# Altium project FC_Design.PrjPcb
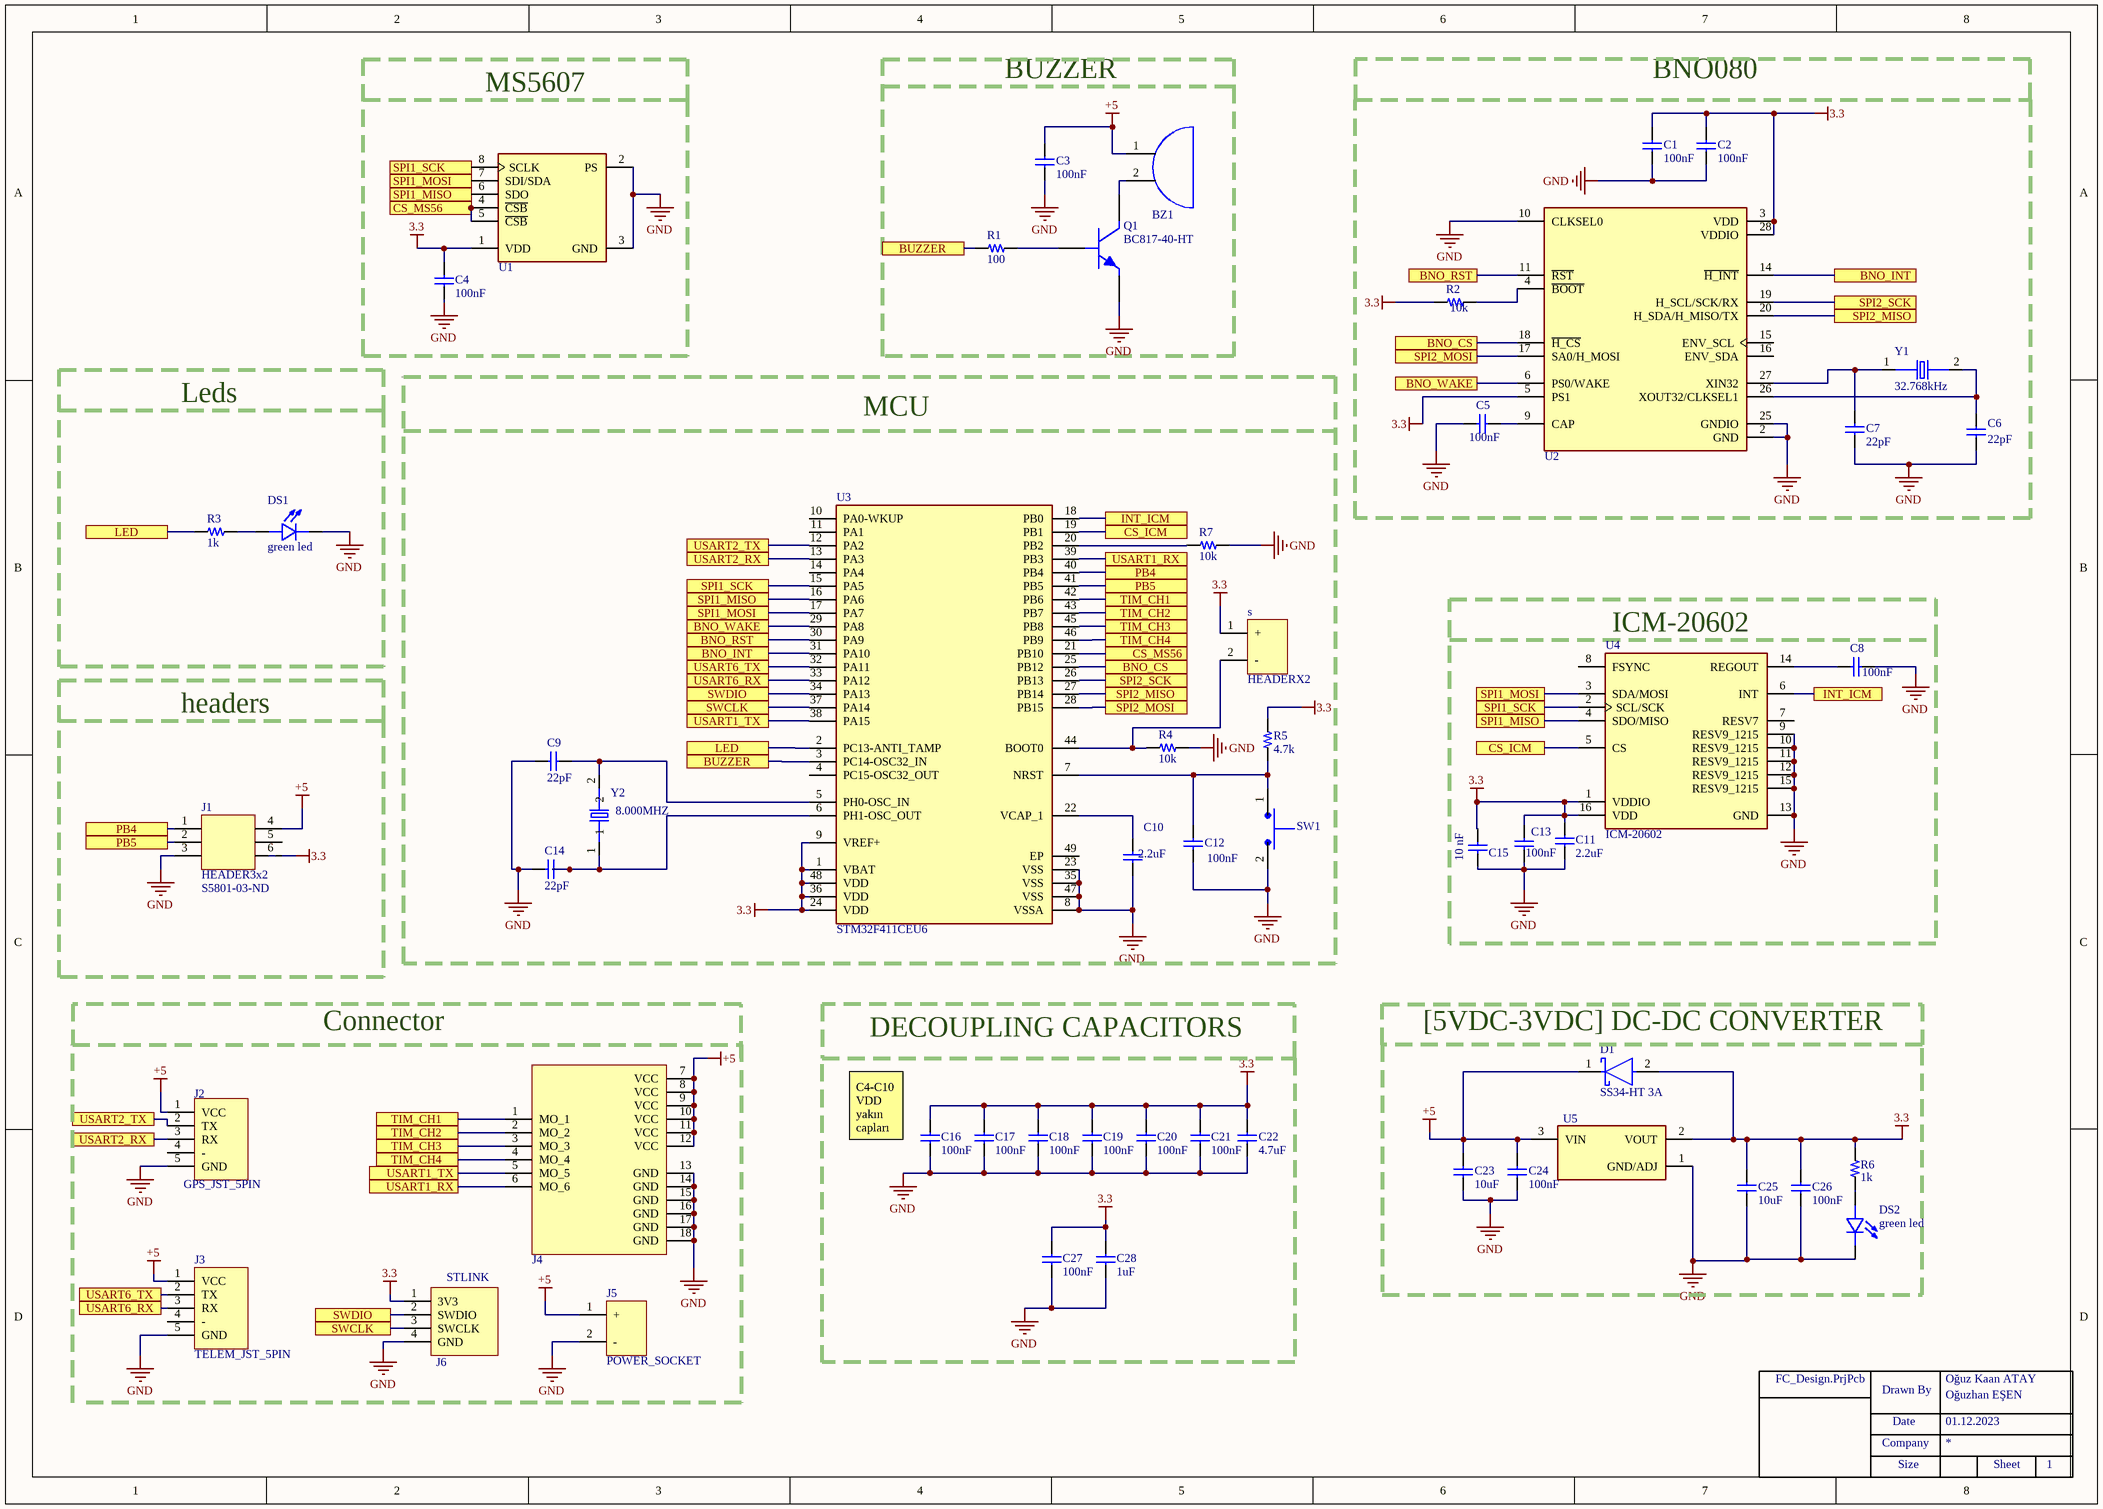
[diagram p0: FC_board.SchDoc]
2 sheets, 55 parts. Net scope: flat (ports and power ports of the same name join across sheets).
Board file: FC_PCB.PcbDoc
Sheets:
  FC_board.SchDoc
  FC_BlockDiagram.SchDoc

## Sheet FC_board.SchDoc
size A3; Date: 01.12.2023; DrawnBy: Oğuz Kaan ATAY; Engineer: Oğuzhan EŞEN; SheetNumber: 1; SheetTotal: 2

### Parts
BZ1  MB9650B05NP  [BUZZER]  (value not drawn)
C1  Capacitance: 100nF  [CAP_0805]  (hidden comment: CL21B105KBFNNNE)
C2  Capacitance: 100nF  [CAP_0805]  (hidden comment: CL21B105KBFNNNE)
C3  Capacitance: 100nF  [CAP_0805]  (hidden comment: CAP CER 100nF 0805)
C4  Capacitance: 100nF  [CAP_0805]  (hidden comment: CAP CER 100nF 0805)
C5  Capacitance: 100nF  [CAP_0805]  (hidden comment: CAP CER  0.1uF 0805)
C6  Capacitance: 22pF  [CAP_0805]  (hidden comment: CL21B105KBFNNNE)
C7  Capacitance: 22pF  [CAP_0805]  (hidden comment: CL21B105KBFNNNE)
C8  Capacitance: 100nF  [CAP_0805]  (hidden comment: CAP CER  0.1uF 0805)
C9  Capacitance: 22pF  [CAP_0805]  (hidden comment: CL21B105KBFNNNE)
C10  Capacitance: 2.2uF  [CAP_0805]  (hidden comment: CL21B105KBFNNNE)
C11  Capacitance: 2.2uF  [CAP_0805]  (hidden comment: CL21A475KAQNNNE)
C12  Capacitance: 100nF  [CAP_0805]
C13  Capacitance: 100nF  [CAP_0805]  (hidden comment: CAP CER  0.1uF 0805)
C14  Capacitance: 22pF  [CAP_0805]  (hidden comment: CL21B105KBFNNNE)
C15  CAP CER 10nF 0805  [CAP_0805]  (value not drawn)
C16  Capacitance: 100nF  [CAP_0805]
C17  Capacitance: 100nF  [CAP_0805]
C18  Capacitance: 100nF  [CAP_0805]
C19  Capacitance: 100nF  [CAP_0805]
C20  Capacitance: 100nF  [CAP_0805]
C21  Capacitance: 100nF  [CAP_0805]
C22  Capacitance: 4.7uF  [CAP_0805]
C23  Capacitance: 10uF  [CAP_0805]  (hidden comment: CAP CER 10uF 0805)
C24  Capacitance: 100nF  [CAP_0805]
C25  Capacitance: 10uF  [CAP_0805]  (hidden comment: CAP CER 10uF 0805)
C26  Capacitance: 100nF  [CAP_0805]
C27  Capacitance: 100nF  [CAP_0805]
C28  Capacitance: 1uF  [CAP_0805]
D1  SS34-HT 3A  [FP-95402-MFG]
DS1  green led  [GREEEN_LED_0805]
DS2  green led  [GREEEN_LED_0805]
J1  HEADER3x2  Supplier Part Number 1: S5801-03-ND  [HEADER3x2]
J2  GPS_JST_5PIN  [JST_5PIN_125]
J3  TELEM_JST_5PIN  [JST_5PIN_125]
J4  Motor_Outputs  [MOTORS]  (value not drawn)
J5  POWER_SOCKET  [JST_2PIN_2.54]
J6  STLINK  [HEADER_4_MALE]
Q1  BC817-40-HT  [SOT23]
R1  100  [RES_0805]
R2  10k  [RES_0805]
R3  1k  [RES_0805]
R4  10k  [RES_0805]
R5  4.7k  [RES_0805]
R6  1k  [RES_0805]
R7  10k  [RES_0805]
s  HEADERX2  [PIN_2.54]
SW1  Switch Tactile  [BUTTON]  (value not drawn)
U1  MS560702BA03-50  [SON125P300X500X100-8N]  (value not drawn)
U2  BNO080  [BNO080]  (value not drawn)
U3  STM32F411CEU6  [QFN50P700X700X60-49N]
U4  ICM-20602  [PQFN50P300X300X80-16N]
U5  LDO Voltage Regulators 1A, 3.3V  [SOT229P700X180-4N]  (value not drawn)
Y1  32.768kHz  [CRYSTAL_32_15]
Y2  8.000MHZ  [ABM3-8.000MHZ-D2Y-T]

### Blocks framed on the sheet
BNO080: C1 C2 C5-C7 R2 U2 Y1
MCU: C9 C10 C12 C14 R4 R5 R7 s SW1 U3 Y2
[5VDC-3VDC] DC-DC CONVERTER: C23-C26 D1 DS2 R6 U5

### Ports
BNO_CS, BNO_INT, BNO_RST, BNO_WAKE, BUZZER, CS_ICM, CS_MS56, INT_ICM, LED, PB4, PB5, SPI1_MISO, SPI1_MOSI, SPI1_SCK, SPI2_MISO, SPI2_MOSI, SPI2_SCK, SWCLK, SWDIO, TIM_CH1, TIM_CH2, TIM_CH3, TIM_CH4, USART1_RX, USART1_TX, USART2_RX, USART2_TX, USART6_RX, USART6_TX

### Nets
3.3: C1.2 C2.2 C4.2 C11.2 C13.1 C15.2 C16.2 C17.2 C18.2 C19.2 C20.2 C21.2 C22.2 C25.2 C26.2 C27.2 C28.2 D1.2(A) J1.6 J6.1(3V3) R2.2 R5.1 R6.1 s.1(+) U1.1(VDD) U2.3(VDD) U2.5(PS1) U2.28(VDDIO) U3.1(VBAT) U3.9(VREF+) U3.24(VDD) U3.36(VDD) U3.48(VDD) U4.1(VDDIO) U4.16(VDD) U5.2(VOUT)
+5: BZ1.1(GND) C3.2 C23.2 C24.2 D1.1(C) J1.4 J2.1(VCC) J3.1(VCC) J4.7(VCC) J4.8(VCC) J4.9(VCC) J4.10(VCC) J4.11(VCC) J4.12(VCC) J5.1(+) U5.3(VIN)
GND: C1.1 C2.1 C3.1 C4.1 C5.1 C6.1 C7.1 C8.2 C9.1 C10.1 C11.1 C12.1 C13.2 C14.1 C15.1 C16.1 C17.1 C18.1 C19.1 C20.1 C21.1 C22.1 C23.1 C24.1 C25.1 C26.1 C27.1 C28.1 DS1.2 DS2.2 J1.3 J2.5(GND) J3.5(GND) J4.13(GND) J4.14(GND) J4.15(GND) J4.16(GND) J4.17(GND) J4.18(GND) J5.2(-) J6.4(GND) Q1.2(E) R4.1 R7.1 SW1.2 U1.2(PS) U1.3(GND) U2.2(GND) U2.10(CLKSEL0) U2.25(GNDIO) U3.8(VSSA) U3.23(VSS) U3.35(VSS) U3.47(VSS) U4.9(RESV9_1215) U4.10(RESV9_1215) U4.11(RESV9_1215) U4.12(RESV9_1215) U4.13(GND) U4.15(RESV9_1215) U5.1(GND/ADJ)
NetBZ1_2: BZ1.2(GND) Q1.3(C)
NetC5_2: C5.2 U2.9(CAP)
NetC6_2: C6.2 U2.26(XOUT32/CLKSEL1) Y1.2
NetC7_2: C7.2 U2.27(XIN32) Y1.1
NetC8_1: C8.1 U4.14(REGOUT)
NetC9_2: C9.2 U3.5(PH0-OSC_IN) Y2.2
NetC10_2: C10.2 U3.22(VCAP_1)
NetC12_2: C12.2 R5.2 SW1.1 U3.7(NRST)
NetC14_2: C14.2 U3.6(PH1-OSC_OUT) Y2.1
NetDS1_1: DS1.1 R3.1
NetDS2_1: DS2.1 R6.2
NetJ1_1: J1.1 U3.40(PB4) ; port PB4
NetJ1_2: J1.2 U3.41(PB5) ; port PB5
NetJ2_2: J2.2(TX) U3.12(PA2) ; port USART2_TX
NetJ2_3: J2.3(RX) U3.13(PA3) ; port USART2_RX
NetJ3_2: J3.2(TX) U3.32(PA11) ; port USART6_TX
NetJ3_3: J3.3(RX) U3.33(PA12) ; port USART6_RX
NetJ4_1: J4.1(MO_1) U3.42(PB6) ; port TIM_CH1
NetJ4_2: J4.2(MO_2) U3.43(PB7) ; port TIM_CH2
NetJ4_3: J4.3(MO_3) U3.45(PB8) ; port TIM_CH3
NetJ4_4: J4.4(MO_4) U3.46(PB9) ; port TIM_CH4
NetJ4_5: J4.5(MO_5) U3.38(PA15) ; port USART1_TX
NetJ4_6: J4.6(MO_6) U3.39(PB3) ; port USART1_RX
NetJ6_2: J6.2(SWDIO) U3.34(PA13) ; port SWDIO
NetJ6_3: J6.3(SWCLK) U3.37(PA14) ; port SWCLK
NetQ1_1: Q1.1(B) R1.1
NetR1_2: R1.2 U3.3(PC14-OSC32_IN) ; port BUZZER
NetR2_1: R2.1 U2.4(~{BOOT})
NetR3_2: R3.2 U3.2(PC13-ANTI_TAMP) ; port LED
NetR4_2: R4.2 s.2(-) U3.44(BOOT0)
NetR7_2: R7.2 U3.20(PB2)
NetU1_4: U1.4(~{CSB}) U1.5(~{CSB}) U3.21(PB10) ; port CS_MS56
NetU1_6: U1.6(SDO) U3.16(PA6) U4.4(SDO/MISO) ; port SPI1_MISO
NetU1_7: U1.7(SDI/SDA) U3.17(PA7) U4.3(SDA/MOSI) ; port SPI1_MOSI
NetU1_8: U1.8(SCLK) U3.15(PA5) U4.2(SCL/SCK) ; port SPI1_SCK
NetU2_6: U2.6(PS0/WAKE) U3.29(PA8) ; port BNO_WAKE
NetU2_11: U2.11(~{RST}) U3.30(PA9) ; port BNO_RST
NetU2_14: U2.14(~{H_INT}) U3.31(PA10) ; port BNO_INT
NetU2_17: U2.17(SA0/H_MOSI) U3.28(PB15) ; port SPI2_MOSI
NetU2_18: U2.18(~{H_CS}) U3.25(PB12) ; port BNO_CS
NetU2_19: U2.19(H_SCL/SCK/RX) U3.26(PB13) ; port SPI2_SCK
NetU2_20: U2.20(H_SDA/H_MISO/TX) U3.27(PB14) ; port SPI2_MISO
NetU3_18: U3.18(PB0) U4.6(INT) ; port INT_ICM
NetU3_19: U3.19(PB1) U4.5(CS) ; port CS_ICM

Not connected (* = marked no-connect by the designer): J1 5; J2 4(-); J3 4(-); U2 15(ENV_SCL) 16(ENV_SDA); U3 4(PC15-OSC32_OUT) 10(PA0-WKUP) 11(PA1) 14(PA4) 49(EP); U4 7(RESV7) 8(FSYNC)

### Notes on the sheet
- MS5607
- BUZZER
- Leds
- (near U4) ICM-20602
- headers
- Connector
- DECOUPLING CAPACITORS
- (near C16) C4-C10 VDD yakın capları
- Drawn By
- Company
- Date
- Size
- Sheet
- (in symbol CAP CER 10nF 0805) 10 nF

### Library data of the parts
C1 C2 = CAP CER 1uF 0805: CAP CER 1UF 50V X7R 0805; Manufacturer: Samsung; Tolerance: 10%; Designed by: Oğuzhan EŞEN; Supplier 1: Digi-Key; Manufacturer Part Number: CL21B105KBFNNNE; RoHS: Yes; Category: Ceramic Capacitors; Stock 1: 257617; Pricing 1: 1=0,11000, 10=0,07900, 50=0,04500, 100=0,03730, 500=0,02616, 1000=0,02165 (USD); Mount: Surface Mount; Case/Package: 0805; Case Code (Metric): 2012; Case Code (Imperial): 0805; Min Operating Temperature: -55°C; Max Operating Temperature: 125°C; Packaging: Tape and Reel; Package Quantity: 1; Voltage Rating: 50V; Dielectric: X7R; Voltage: 50V; Series: CL; Construction: Flat; Length: 2mm; Width: 0.049inch; Height: 1.25mm; Thickness: 0.053inch; Depth: 1.25mm; Radiation Hardening: No; RoHS Compliant: Yes; ComponentLink1URL: https://datasheet.ciiva.com/25800/cl21b105kbfnnne-25800291.pdf?src-supplier=Digi-Key; ComponentLink1Description: https://datasheet.ciiva.com/25800/cl21b105kbfnnne-25800291.pdf?src-supplier=Digi-Key; ComponentLink2URL: https://datasheet.ciiva.com/16449/cl21b105kbfnnne-16449003.pdf?src-supplier=Future+Electronics; ComponentLink2Description: https://datasheet.ciiva.com/16449/cl21b105kbfnnne-16449003.pdf?src-supplier=Future+Electronics; ComponentLink3URL: https://datasheet.ciiva.com/26838/getdatasheetpartid-354075-26838668.pdf?src-supplier=Verical; ComponentLink3Description: https://datasheet.ciiva.com/26838/getdatasheetpartid-354075-26838668.pdf?src-supplier=Verical; Supplier Part Number 1: 1276-1029-1-ND
C3 C4 C24 C26 C27 = CAP CER 100nF 0805: CAP CER 100nF 50V X7R 0805; Manufacturer: Samsung; Manufacturer Part Number: CL21B105KBFNNNE; Tolerance: 10%; Designed by: Oğuzhan EŞEN; Supplier 1: Digi-Key; RoHS: Yes; Category: Ceramic Capacitors; Stock 1: 257617; Pricing 1: 1=0,11000, 10=0,07900, 50=0,04500, 100=0,03730, 500=0,02616, 1000=0,02165 (USD); Mount: Surface Mount; Case/Package: 0805; Case Code (Metric): 2012; Case Code (Imperial): 0805; Min Operating Temperature: -55°C; Max Operating Temperature: 125°C; Packaging: Tape and Reel; Package Quantity: 1; Voltage Rating: 50V; Dielectric: X7R; Voltage: 50V; Series: CL; Construction: Flat; Length: 2mm; Width: 0.049inch; Height: 1.25mm; Thickness: 0.053inch; Depth: 1.25mm; Radiation Hardening: No; RoHS Compliant: Yes; ComponentLink1URL: https://datasheet.ciiva.com/25800/cl21b105kbfnnne-25800291.pdf?src-supplier=Digi-Key; ComponentLink1Description: https://datasheet.ciiva.com/25800/cl21b105kbfnnne-25800291.pdf?src-supplier=Digi-Key; ComponentLink2URL: https://datasheet.ciiva.com/16449/cl21b105kbfnnne-16449003.pdf?src-supplier=Future+Electronics; ComponentLink2Description: https://datasheet.ciiva.com/16449/cl21b105kbfnnne-16449003.pdf?src-supplier=Future+Electronics; ComponentLink3URL: https://datasheet.ciiva.com/26838/getdatasheetpartid-354075-26838668.pdf?src-supplier=Verical; ComponentLink3Description: https://datasheet.ciiva.com/26838/getdatasheetpartid-354075-26838668.pdf?src-supplier=Verical; Supplier Part Number 1: 1276-1029-1-ND
C5 C8 C12 C13 = CAP CER  0.1uF 0805: CAP CER  0.1UF 50V X7R 0805; Manufacturer: Samsung; Manufacturer Part Number: CL21B105KBFNNNE; Tolerance: 10%; Designed by: Oğuzhan EŞEN; Supplier 1: Digi-Key; RoHS: Yes; Category: Ceramic Capacitors; Stock 1: 257617; Pricing 1: 1=0,11000, 10=0,07900, 50=0,04500, 100=0,03730, 500=0,02616, 1000=0,02165 (USD); Mount: Surface Mount; Case/Package: 0805; Case Code (Metric): 2012; Case Code (Imperial): 0805; Min Operating Temperature: -55°C; Max Operating Temperature: 125°C; Packaging: Tape and Reel; Package Quantity: 1; Voltage Rating: 50V; Dielectric: X7R; Voltage: 50V; Series: CL; Construction: Flat; Length: 2mm; Width: 0.049inch; Height: 1.25mm; Thickness: 0.053inch; Depth: 1.25mm; Radiation Hardening: No; RoHS Compliant: Yes; ComponentLink1URL: https://datasheet.ciiva.com/25800/cl21b105kbfnnne-25800291.pdf?src-supplier=Digi-Key; ComponentLink1Description: https://datasheet.ciiva.com/25800/cl21b105kbfnnne-25800291.pdf?src-supplier=Digi-Key; ComponentLink2URL: https://datasheet.ciiva.com/16449/cl21b105kbfnnne-16449003.pdf?src-supplier=Future+Electronics; ComponentLink2Description: https://datasheet.ciiva.com/16449/cl21b105kbfnnne-16449003.pdf?src-supplier=Future+Electronics; ComponentLink3URL: https://datasheet.ciiva.com/26838/getdatasheetpartid-354075-26838668.pdf?src-supplier=Verical; ComponentLink3Description: https://datasheet.ciiva.com/26838/getdatasheetpartid-354075-26838668.pdf?src-supplier=Verical; Supplier Part Number 1: 1276-1029-1-ND
C6 C7 C9 C10 C14 = CAP CER 22pF 0805: CAP CER 22pF 50V X7R 0805; Manufacturer: Samsung; Tolerance: 10%; Designed by: Oğuzhan EŞEN; Supplier 1: Digi-Key; Manufacturer Part Number: CL21B105KBFNNNE; RoHS: Yes; Category: Ceramic Capacitors; Stock 1: 257617; Pricing 1: 1=0,11000, 10=0,07900, 50=0,04500, 100=0,03730, 500=0,02616, 1000=0,02165 (USD); Mount: Surface Mount; Case/Package: 0805; Case Code (Metric): 2012; Case Code (Imperial): 0805; Min Operating Temperature: -55°C; Max Operating Temperature: 125°C; Packaging: Tape and Reel; Package Quantity: 1; Voltage Rating: 50V; Dielectric: X7R; Voltage: 50V; Series: CL; Construction: Flat; Length: 2mm; Width: 0.049inch; Height: 1.25mm; Thickness: 0.053inch; Depth: 1.25mm; Radiation Hardening: No; RoHS Compliant: Yes; ComponentLink1URL: https://datasheet.ciiva.com/25800/cl21b105kbfnnne-25800291.pdf?src-supplier=Digi-Key; ComponentLink1Description: https://datasheet.ciiva.com/25800/cl21b105kbfnnne-25800291.pdf?src-supplier=Digi-Key; ComponentLink2URL: https://datasheet.ciiva.com/16449/cl21b105kbfnnne-16449003.pdf?src-supplier=Future+Electronics; ComponentLink2Description: https://datasheet.ciiva.com/16449/cl21b105kbfnnne-16449003.pdf?src-supplier=Future+Electronics; ComponentLink3URL: https://datasheet.ciiva.com/26838/getdatasheetpartid-354075-26838668.pdf?src-supplier=Verical; ComponentLink3Description: https://datasheet.ciiva.com/26838/getdatasheetpartid-354075-26838668.pdf?src-supplier=Verical; Supplier Part Number 1: 1276-1029-1-ND
C11 = CAP CER 2.2uF 0805_1: CAP CER  2.2UF 50V X7R 0805; Manufacturer: Samsung; Tolerance: 10%; Voltage Rating: 25V; Dielectric: X5R; Designed by: Oğuzhan EŞEN; Supplier 1: Digi-Key; Manufacturer Part Number: CL21A475KAQNNNE; RoHS: Yes; Category: Ceramic Capacitors; Stock 1: 4905114; Pricing 1: 1=0,10000, 10=0,07300, 50=0,04140, 100=0,03440, 500=0,02408, 1000=0,01994 (USD); Mount: Surface Mount; Case/Package: 0805; Case Code (Metric): 2012; Case Code (Imperial): 0805; Min Operating Temperature: -55°C; Max Operating Temperature: 85°C; Package Quantity: 1; Packaging: Tape and Reel; Voltage Rating (DC): 25V; Series: CL; Construction: Flat; Length: 2mm; Width: 0.049inch; Height: 1.25mm; Thickness: 0.055inch; Depth: 1.25mm; Radiation Hardening: No; Lead Free: Lead Free; RoHS Compliant: Yes; ComponentLink1URL: https://datasheet.ciiva.com/25798/cl21a475kaqnnne-25798882.pdf?src-supplier=Digi-Key; ComponentLink1Description: https://datasheet.ciiva.com/25798/cl21a475kaqnnne-25798882.pdf?src-supplier=Digi-Key; Supplier Part Number 1: 1276-1244-1-ND
C15 = CAP CER 10nF 0805: CAP CER  10nF 50V X7R 0805
C16-C21 = CAP CER 100pF 0805: CAP CER 100pF 50V X7R 0805; Manufacturer: Samsung; Manufacturer Part Number: CL21B105KBFNNNE; Tolerance: 10%; Designed by: Oğuzhan EŞEN; Supplier 1: Digi-Key; RoHS: Yes; Category: Ceramic Capacitors; Stock 1: 257617; Pricing 1: 1=0,11000, 10=0,07900, 50=0,04500, 100=0,03730, 500=0,02616, 1000=0,02165 (USD); Mount: Surface Mount; Case/Package: 0805; Case Code (Metric): 2012; Case Code (Imperial): 0805; Min Operating Temperature: -55°C; Max Operating Temperature: 125°C; Packaging: Tape and Reel; Package Quantity: 1; Voltage Rating: 50V; Dielectric: X7R; Voltage: 50V; Series: CL; Construction: Flat; Length: 2mm; Width: 0.049inch; Height: 1.25mm; Thickness: 0.053inch; Depth: 1.25mm; Radiation Hardening: No; RoHS Compliant: Yes; ComponentLink1URL: https://datasheet.ciiva.com/25800/cl21b105kbfnnne-25800291.pdf?src-supplier=Digi-Key; ComponentLink1Description: https://datasheet.ciiva.com/25800/cl21b105kbfnnne-25800291.pdf?src-supplier=Digi-Key; ComponentLink2URL: https://datasheet.ciiva.com/16449/cl21b105kbfnnne-16449003.pdf?src-supplier=Future+Electronics; ComponentLink2Description: https://datasheet.ciiva.com/16449/cl21b105kbfnnne-16449003.pdf?src-supplier=Future+Electronics; ComponentLink3URL: https://datasheet.ciiva.com/26838/getdatasheetpartid-354075-26838668.pdf?src-supplier=Verical; ComponentLink3Description: https://datasheet.ciiva.com/26838/getdatasheetpartid-354075-26838668.pdf?src-supplier=Verical; Supplier Part Number 1: 1276-1029-1-ND
C22 = CAP CER 4,7uF 0805: CAP CER 4.7UF 25V X5R 0805; Manufacturer: Samsung; Manufacturer Part Number: CL21A475KAQNNNE; Tolerance: 10%; Designed by: Oğuzhan EŞEN; Supplier 1: Digi-Key; RoHS: Yes; Category: Ceramic Capacitors; Stock 1: 4905114; Pricing 1: 1=0,10000, 10=0,07300, 50=0,04140, 100=0,03440, 500=0,02408, 1000=0,01994 (USD); Mount: Surface Mount; Case/Package: 0805; Case Code (Metric): 2012; Case Code (Imperial): 0805; Min Operating Temperature: -55°C; Max Operating Temperature: 85°C; Package Quantity: 1; Packaging: Tape and Reel; Voltage Rating: 25V; Dielectric: X5R; Voltage Rating (DC): 25V; Series: CL; Construction: Flat; Length: 2mm; Width: 0.049inch; Height: 1.25mm; Thickness: 0.055inch; Depth: 1.25mm; Radiation Hardening: No; Lead Free: Lead Free; RoHS Compliant: Yes; ComponentLink1URL: https://datasheet.ciiva.com/25798/cl21a475kaqnnne-25798882.pdf?src-supplier=Digi-Key; ComponentLink1Description: https://datasheet.ciiva.com/25798/cl21a475kaqnnne-25798882.pdf?src-supplier=Digi-Key; Supplier Part Number 1: 1276-1244-1-ND
C23 C25 = CAP CER 10uF 0805: CAP CER 10uF 25V X5R 0805; Manufacturer: Samsung; Manufacturer Part Number: CL21A475KAQNNNE; Tolerance: 10%; Designed by: Oğuzhan EŞEN; Supplier 1: Digi-Key; RoHS: Yes; Category: Ceramic Capacitors; Stock 1: 4905114; Pricing 1: 1=0,10000, 10=0,07300, 50=0,04140, 100=0,03440, 500=0,02408, 1000=0,01994 (USD); Mount: Surface Mount; Case/Package: 0805; Case Code (Metric): 2012; Case Code (Imperial): 0805; Min Operating Temperature: -55°C; Max Operating Temperature: 85°C; Package Quantity: 1; Packaging: Tape and Reel; Voltage Rating: 25V; Dielectric: X5R; Voltage Rating (DC): 25V; Series: CL; Construction: Flat; Length: 2mm; Width: 0.049inch; Height: 1.25mm; Thickness: 0.055inch; Depth: 1.25mm; Radiation Hardening: No; Lead Free: Lead Free; RoHS Compliant: Yes; ComponentLink1URL: https://datasheet.ciiva.com/25798/cl21a475kaqnnne-25798882.pdf?src-supplier=Digi-Key; ComponentLink1Description: https://datasheet.ciiva.com/25798/cl21a475kaqnnne-25798882.pdf?src-supplier=Digi-Key; Supplier Part Number 1: 1276-1244-1-ND
C28 = CAP CER 1uF 0805: CAP CER 1UF 50V X7R 0805; Manufacturer: Samsung; Manufacturer Part Number: CL21B105KBFNNNE; Tolerance: 10%; Designed by: Oğuzhan EŞEN; Supplier 1: Digi-Key; RoHS: Yes; Category: Ceramic Capacitors; Stock 1: 257617; Pricing 1: 1=0,11000, 10=0,07900, 50=0,04500, 100=0,03730, 500=0,02616, 1000=0,02165 (USD); Mount: Surface Mount; Case/Package: 0805; Case Code (Metric): 2012; Case Code (Imperial): 0805; Min Operating Temperature: -55°C; Max Operating Temperature: 125°C; Packaging: Tape and Reel; Package Quantity: 1; Voltage Rating: 50V; Dielectric: X7R; Voltage: 50V; Series: CL; Construction: Flat; Length: 2mm; Width: 0.049inch; Height: 1.25mm; Thickness: 0.053inch; Depth: 1.25mm; Radiation Hardening: No; RoHS Compliant: Yes; ComponentLink1URL: https://datasheet.ciiva.com/25800/cl21b105kbfnnne-25800291.pdf?src-supplier=Digi-Key; ComponentLink1Description: https://datasheet.ciiva.com/25800/cl21b105kbfnnne-25800291.pdf?src-supplier=Digi-Key; ComponentLink2URL: https://datasheet.ciiva.com/16449/cl21b105kbfnnne-16449003.pdf?src-supplier=Future+Electronics; ComponentLink2Description: https://datasheet.ciiva.com/16449/cl21b105kbfnnne-16449003.pdf?src-supplier=Future+Electronics; ComponentLink3URL: https://datasheet.ciiva.com/26838/getdatasheetpartid-354075-26838668.pdf?src-supplier=Verical; ComponentLink3Description: https://datasheet.ciiva.com/26838/getdatasheetpartid-354075-26838668.pdf?src-supplier=Verical; Supplier Part Number 1: 1276-1029-1-ND
D1 = CMP-02539-000012-1: DIODE SCHOTTKY 40V 3A DIODE SCHOTTKY 40V 3A DO214AB; Manufacturer: Vishay; Manufacturer Part Number: SS34-E3/57T; Max Junction Temp: +150°C; Peak Reverse Current: 0.5mA; Max Surge Forward Current: 100A; Standoff Height: 0mm; ComponentLink2Description: Datasheet; Device Class L3: Schottky Diodes; Height: 2.62mm; Max Repetitive Reverse Voltage: 40V; Lead Free: Yes; Package: 95402; Temperature Range High: +150°C; ComponentLink2URL: http://www.vishay.com/docs/88751/ss32.pdf; Temperature: -55°C to +150°C; Footprint Url: http://www.vishay.com/docs/95402/smc.pdf; Automotive: No; Forward Current: 3A; Category: Diode; RoHS: TRUE; Device Class L2: Diodes; Mouser Description: Schottky Diodes & Rectifiers 3.0 Amp 40 Volt; Octopart: https://octopart.com/ss34-e3%2F57t-vishay-39552907; Temperature Range Low: -55°C; Device Class L1: Discrete Semiconductors; Digikey Description: DIODE SCHOTTKY 40V 3A DO214AB
J1 = HEADER3x2: CONN HEADER 2MM DUAL STR 6POS; Manufacturer: Sullins; Manufacturer Part Number: NRPN032PAEN-RC; Designed by: Oğuzhan EŞEN; ComponentLink1URL: https://datasheet.ciiva.com/10103/54102-10103325.pdf?src-supplier=Avnet; ComponentLink1Description: https://datasheet.ciiva.com/10103/54102-10103325.pdf?src-supplier=Avnet; Supplier 1: Digi-Key; RoHS: Yes; Category: Connectors; Stock 1: 6312; Pricing 1: 1=0,33000, 10=0,31100, 25=0,26680, 50=0,22680, 100=0,21790, 250=0,19564, 500=0,18674 (USD); ComponentLink2URL: https://datasheet.ciiva.com/6859/nrpnxx2paen-rcrevf-6859114.pdf?src-supplier=Digi-Key; ComponentLink2Description: https://datasheet.ciiva.com/6859/nrpnxx2paen-rcrevf-6859114.pdf?src-supplier=Digi-Key
J6 = RECIVER
Q1 = BC817-40-HT: npn transistor
R1-R7 = RESISTOR_0805: 910 Ohms Â±1% 0.125W, 1/8W Chip Resistor 0805 (2012 Metric) Moisture Resistant Thick Film; MF: Yageo; MP: RC0805FR-07910RL; Package: 2012 Rohm Semiconductor; Value: *; Purchase-URL: https://pricing.snapeda.com/search/part/RC0805FR-07910RL/?ref=eda; Availability: In Stock; Price: None
SW1 = button: Switch Tactile N.O. SPST Rectangular Button J-Bend 0.02A 15VDC 5N SMD Embossed Tape and Reel; Manufacturer: Panasonic; Manufacturer Part Number: EVQP9H02W; Mechanical Life: 200000Cycles; Operating Force: 500gf; Illumination Type: Non-Illuminated; Max Voltage Rating (DC): 15V; Switch Function: Off-Mom; Switch Travel: 0.25mm; Designed by: Oğuzhan EŞEN; Supplier 1: Digi-Key; RoHS: No; Category: Tactile Switches; Stock 1: 4000; Pricing 1: 4000=0,50133, 8000=0,46791, 12000=0,43449 (USD); Mount: Surface Mount; Case/Package: SMD/SMT; Min Operating Temperature: -40°C; Max Operating Temperature: 85°C; Package Quantity: 4000; Packaging: Tape and Reel; Throw Configuration: SPST; Termination: J-Bend; Radiation Hardening: No; RoHS Compliant: No; ComponentLink1URL: https://datasheet.ciiva.com/29974/atv0000ce7-29974074.pdf?src-supplier=Avnet; ComponentLink1Description: https://datasheet.ciiva.com/29974/atv0000ce7-29974074.pdf?src-supplier=Avnet; Supplier Part Number 1: P15948STR-ND
U1 = MS560702BA03-50: MS5607-02BA03 Series 3 V 1 to 120 kPa Absolute Barometric Pressure Sensor; MF: TE Connectivity; MP: MS560702BA03-50; EU_RoHS_Compliance: Compliant; Package: SMD-8 TE Connectivity; TE_purchase_URL: https://www.te.com/usa-en/product-MS560702BA03-50.html?te_bu=Cor&te_type=disp&te_campaign=seda_glo_cor-seda-global-disp-prtnr-fy19-seda-model-bom-cta_sma-317_1&elqCampaignId=32493; SnapEDA_Link: https://www.snapeda.com/parts/MS560702BA03-50/TE%20Connectivity%20ALCOSWITCH%20Switches/view-part/480584/?ref=snap; Availability: Unavailable; Price: None; Value: *
U2 = BNO080: Accelerometer, Gyroscope, Magnetometer, 9 Axis Sensor IÂ²C, SPI, UART Output; MF: Hillcrest Laboratories,; Package: TFLGA-28 Hillcrest Laboratories,; Digi-Key_Purchase_URL: https://www.digikey.com/product-detail/en/hillcrest-laboratories-inc/BNO080/1888-1000-1-ND/7917169?utm_source=snapeda&utm_medium=aggregator&utm_campaign=symbol; Value: *; MP: BNO080; SnapEDA_Link: https://www.snapeda.com/parts/BNO080/Hillcrest%20Laboratories%2C%20Inc./view-part/2769909/?ref=snap; Digi-Key_Part_Number: 1888-1000-1-ND
U3 = STM32F411CEU6: High-performance access line, ARM Cortex-M4 core with DSP and FPU, 512 Kbytes Flash, 100 MHz CPU, ART Accelerator; Package: None; Availability: Unavailable; Value: *; MP: STM32F411CEU6; Price: None
U4 = ICM-20602: Accelerometer and Gyroscope Digital 16-Pin LGA <a href="https://pricing.snapeda.com/parts/IAM-20680/TDK%20InvenSense/view-part?ref=eda">Check prices</a>; Package: None; Availability: Unavailable; MP: ICM-20602; Value: *; Price: None
U5 = AMS1117
Y1 = FC-135 BNO: 32.768kHz Â±20ppm Crystal 7pF 70 kOhms 2-SMD, No Lead; MP: FC-135; MF: EPSON; Value: *; SnapEDA_Link: https://www.snapeda.com/parts/FC-135/EPSON/view-part/491615/?ref=snap; Check_prices: https://www.snapeda.com/parts/FC-135/EPSON/view-part/491615/?ref=eda; Availability: Unavailable; Price: None; Package: SMD-2 Epson
Y2 = STM_CRYSTAL: ABM3-8.000MHZ-D2Y-T

## Sheet FC_BlockDiagram.SchDoc
size A3; Date: 01.12.2023; DrawnBy: Oğuz Kaan ATAY; Engineer: Oğuzhan EŞEN; SheetNumber: 2; SheetTotal: 2
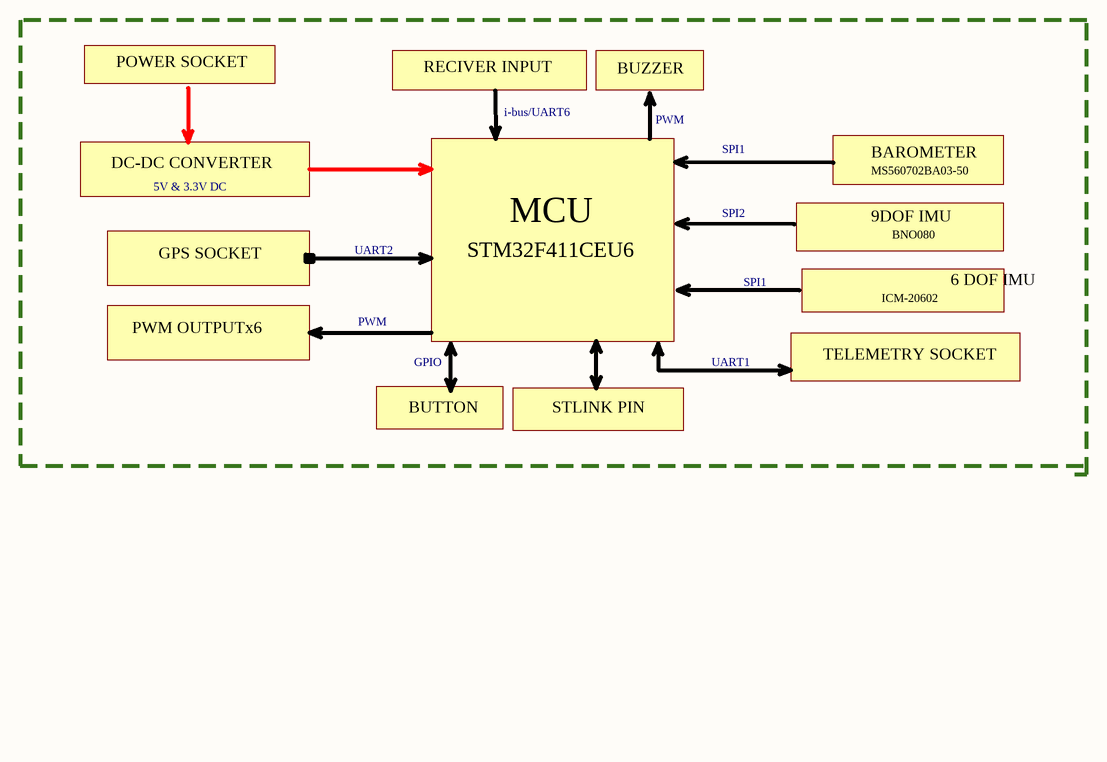
[diagram p1: FC_BlockDiagram.SchDoc]

### Notes on the sheet
- POWER SOCKET
- RECIVER INPUT
- i-bus/UART6
- BUZZER
- PWM
- DC-DC CONVERTER
- 5V & 3.3V DC
- SPI1
- BAROMETER
- MS560702BA03-50
- GPS SOCKET
- UART2
- STM32F411CEU6
- MCU
- SPI2
- 9DOF IMU
- BNO080
- ICM-20602
- 6 DOF IMU
- PWM OUTPUTx6
- GPIO
- UART1
- TELEMETRY SOCKET
- BUTTON
- STLINK PIN
- -KOMPANENTLER-
  MCU:TFPT1206L1002FM
  BAROMETRE:M41T00
  9DOF IMU:ESP32-WROOM-32E(4MB)
  6 DOF IMU:LHI 876/3902
  GPS:MAX6662MSA+
  TELEMETRY:STM32F103C6T6A
  RELAY:ALQ112
  BUZZER:CMI-9605IC-0580T
  SENSOR ON/OFF:EG1215AA
  3.3V DC: AP7361-33E-13
- Drawn By
- Company
- Date
- Size
- Sheet